# EAGLE schematic PR5004 (EAGLE 6.5.0)
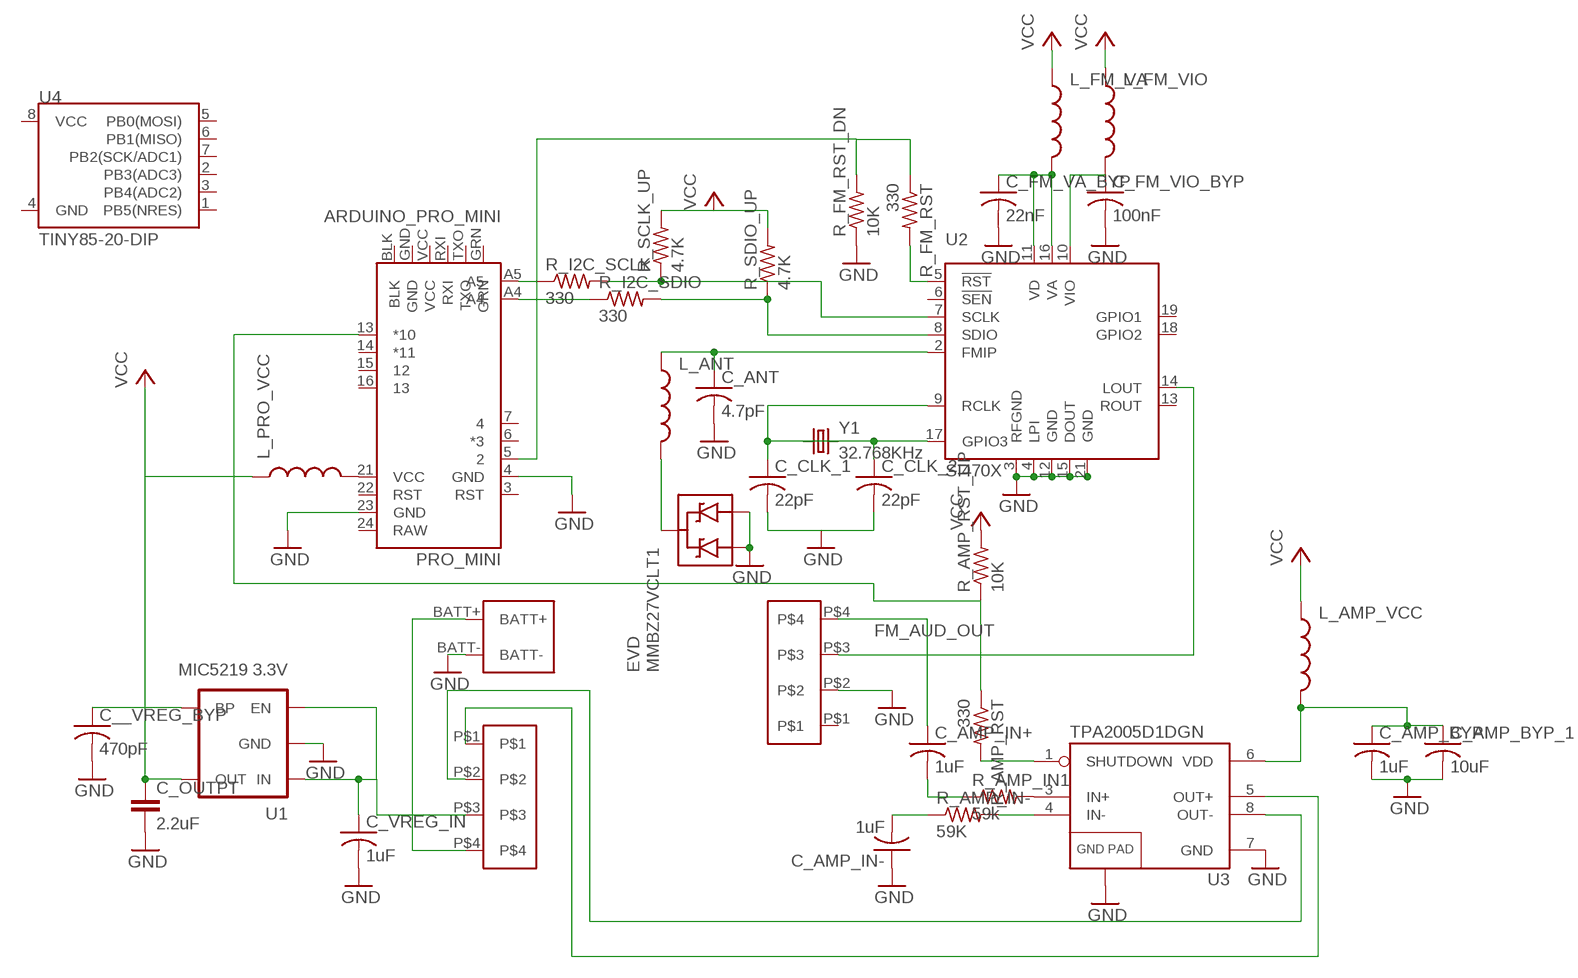
[diagram p0: schematic, sheet 1]

## Parts
ANT/POT_VOL  OSTVN04  [OSTVN04]
ANT/POT_VOL1  OSTVN04  [OSTVN04]
BATT_IN  KEYSTONE_2479_3XAAA_BOTTOM  [KEYSTONE_2479_3XAAA_BOTTOM]
C__VREG_BYP  470pF  C-USC0603  [C0603]
C_AMP_BYP  1uF  C-USC0603  [C0603]
C_AMP_BYP_1  10uF  C-USC0603  [C0603]
C_AMP_IN+  1uF  C-USC0603  [C0603]
C_AMP_IN-  1uF  C-USC0603  [C0603]
C_ANT  4.7pF  C-USC0805  [C0805]
C_CLK_1  22pF  C-USC0603  [C0603]
C_CLK_2  22pF  C-USC0603  [C0603]
C_FM_VA_BYP  22nF  C-USC0603  [C0603]
C_FM_VIO_BYP  100nF  C-USC0603  [C0603]
C_OUTPT  2.2uF  VISHAY_TR3C  [VISHAY_TR3C]
C_VREG_IN  1uF  C-USC0603  [C0603]
EVD  MMBZ27VCLT1  [SOT23-3]
L_AMP_VCC  INDUCTOR0603  [0603]
L_ANT  INDUCTOR0805  [0805]
L_FM_VA  INDUCTOR0603  [0603]
L_FM_VIO  INDUCTOR0603  [0603]
L_PRO_VCC  INDUCTOR0603  [0603]
PRO_MINI  ARDUINO_PRO_MINI  [ARDUINO_PRO_MINI]
R_AMP_IN1  59k  R-US_R0603  [R0603]
R_AMP_IN-  59K  R-US_R0603  [R0603]
R_AMP_RST  330  R-US_R0603  [R0603]
R_AMP_RST_UP  10K  R-US_R0603  [R0603]
R_FM_RST  330  R-US_R0603  [R0603]
R_FM_RST_DN  10K  R-US_R0603  [R0603]
R_I2C_SCLK  330  R-US_R0603  [R0603]
R_I2C_SDIO  330  R-US_R0603  [R0603]
R_SCLK_UP  4.7K  R-US_R0603  [R0603]
R_SDIO_UP  4.7K  R-US_R0603  [R0603]
U1  MIC5219 3.3V  V_REG_MIC52193.3V  [SOT23-5]
U2  SI470X  [SI470X]
U3  TPA2005D1DGN  [POWER-SOP8]
U4  TINY85-20-DIP  ATTINY45TINY85-20-DIP  [DIP08]
Y1  32.768KHz  CRYSTAL32-SMD  [CRYSTAL-32KHZ-SMD]

## Nets
ANT: EVD.3(C) L_ANT.2
BATT+: ANT/POT_VOL1.P$4 BATT_IN.BATT+
FM_AUD_OUT: ANT/POT_VOL.P$3 U2.14(LOUT)
GND [GND]: ANT/POT_VOL.P$2 BATT_IN.BATT- C__VREG_BYP.2 C_AMP_BYP.2 C_AMP_BYP_1.2 C_AMP_IN-.1 C_ANT.2 C_CLK_1.2 C_CLK_2.2 C_FM_VA_BYP.2 C_FM_VIO_BYP.2 C_OUTPT.P$2 C_VREG_IN.2 EVD.1(A1) EVD.2(A2) PRO_MINI.4(GND) PRO_MINI.23(GND) R_FM_RST_DN.1 U1.2(GND) U2.3(RFGND) U2.4(LPI) U2.12(GND) U2.15(DOUT) U2.21(GND) U3.7(GND) U3.9(GND)
N$1: C_AMP_IN-.2 R_AMP_IN-.1
N$2: C_AMP_IN+.2 R_AMP_IN1.1
N$3: C_CLK_1.1 U2.9(RCLK) Y1.X2
N$4: R_FM_RST.2 U2.5(!RST)
N$5: PRO_MINI.A5 R_I2C_SCLK.1
N$6: R_I2C_SCLK.2 R_SCLK_UP.1 U2.7(SCLK)
N$7: PRO_MINI.A4 R_I2C_SDIO.1
N$9: R_I2C_SDIO.2 R_SDIO_UP.1 U2.8(SDIO)
N$10: C_ANT.1 L_ANT.1 U2.2(FMIP)
N$11: C_CLK_2.1 U2.17(GPIO3) Y1.X1
N$14: R_AMP_IN1.2 U3.3(IN+)
N$15: R_AMP_IN-.2 U3.4(IN-)
N$16: ANT/POT_VOL1.P$2 U3.8(OUT-)
N$17: ANT/POT_VOL1.P$1 U3.5(OUT+)
N$19: R_AMP_RST.2 U3.1(SHUTDOWN)
N$20: ANT/POT_VOL1.P$3 C_VREG_IN.1 U1.1(IN) U1.3(EN)
N$23: PRO_MINI.5 R_FM_RST.1 R_FM_RST_DN.2
N$25: PRO_MINI.13(*10) R_AMP_RST.1 R_AMP_RST_UP.1
N$27: ANT/POT_VOL.P$4 C_AMP_IN+.1
N$28: C__VREG_BYP.1 U1.4(BP)
N$29: L_PRO_VCC.2 PRO_MINI.21(VCC)
N$30: C_FM_VIO_BYP.1 L_FM_VIO.2 U2.10(VIO)
N$31: C_FM_VA_BYP.1 L_FM_VA.2 U2.11(VD) U2.16(VA)
N$33: C_AMP_BYP.1 C_AMP_BYP_1.1 L_AMP_VCC.2 U3.6(VDD)
VCC: C_OUTPT.P$1 L_AMP_VCC.1 L_FM_VA.1 L_FM_VIO.1 L_PRO_VCC.1 R_AMP_RST_UP.2 R_SCLK_UP.2 R_SDIO_UP.2 U1.5(OUT)
Unconnected: ANT/POT_VOL.P$1 PRO_MINI.3(RST) PRO_MINI.6(*3) PRO_MINI.7 PRO_MINI.14(*11) PRO_MINI.15 PRO_MINI.16 PRO_MINI.22(RST) PRO_MINI.24(RAW) PRO_MINI.BLK PRO_MINI.GND PRO_MINI.GRN PRO_MINI.RXI PRO_MINI.TXO PRO_MINI.VCC U2.6(!SEN) U2.13(ROUT) U2.18(GPIO2) U2.19(GPIO1) U4.1(PB5(NRES)) U4.2(PB3(ADC3)) U4.3(PB4(ADC2)) U4.4(GND) U4.5(PB0(MOSI)) U4.6(PB1(MISO)) U4.7(PB2(SCK/ADC1)) U4.8(VCC)

## Library data of the parts
ANT/POT_VOL ANT/POT_VOL1 = OSTVN On-Shore Term:OSTVN04
BATT_IN = Batteries:KEYSTONE_2479_3XAAA_BOTTOM
C__VREG_BYP C_AMP_BYP C_AMP_BYP_1 C_AMP_IN+ C_AMP_IN- C_ANT C_CLK_1 C_CLK_2 C_FM_VA_BYP C_FM_VIO_BYP C_VREG_IN = resistor:C-US: CAPACITOR, American symbol
C_OUTPT = capacitor-wima:VISHAY_TR3C
EVD = SparkFun-DiscreteSemi:MMBZ27VCLT1: 40W Zener-diode transient voltage suppressor (ESD protection)
L_AMP_VCC L_ANT L_FM_VA L_FM_VIO L_PRO_VCC = SparkFun-Passives:INDUCTOR: Inductors Basic Inductor/Choke - 0603 and 1206. Footprints are not proven and vary greatly between part numbers. SRN6045- 33uH, 20% 1.4A SDR0403-560KL - 56uH, 10%, 500mA RMS/740mA peak
PRO_MINI = Sparkfun_MODIFIED_2:ARDUINO_PRO_MINI
R_AMP_IN1 R_AMP_IN- R_AMP_RST R_AMP_RST_UP R_FM_RST R_FM_RST_DN R_I2C_SCLK R_I2C_SDIO R_SCLK_UP R_SDIO_UP = resistor:R-US_: RESISTOR, American symbol
U1 = SparkFun-PowerIC:V_REG_MIC5219: V_REG MIC5219 Standard 3.3V and 5V 500mA LDO voltage regulator in SOT-23 layout. Micrel part MIC5219. BP (by-pass) pin is used to lower output noise with 470pF cap, may be left open.; PROD_ID: VREG-09872
U2 = SparkFun-RF:SI470X: FM receiver IC. Tested with Si4703. You really only need SEN, RST, SCLK, and SDIO to get a full FM radio working. Antenna comes from headphone jack. See BOB-10344.
U3 = SparkFun-AnalogIC:TPA2005D1: 1.4W MONO CLASS-D AUDIO POWER AMPLIFIER The TPA2005D1 is a 1.4-W high efficiency filter-free class-D audio power amplifier in a BGA, QFN, or MSOP package that requires only three external components. Datasheet: http://focus.ti.com/lit/ds/symlink/tpa2005d1.pdf 1.4 W Into 8 ? From a 5V Supply at THD = 10% (Typ) Maximum Battery Life and Minimum Heat Efficiency With an 8-? Speaker: 84% at 400 mW, 79% at 100 mW 2.8-mA Quiescent Current 0.5-mA Shutdown Current Ideal for Wireless or Cellular Handsets and PDAs Capable of Driving an 8-? Speaker (2.5 V ? VDD ? 5.5 V) and a 4-? Speaker (2.5 V ? VDD ? 4.2 V) Only Three External Components Optimized PWM Output Stage Eliminates LC Output Filter Internally Generated 250-kHz Switching Frequency Eliminates Capacitor and Resistor Improved PSRR (-71 dB at 217 Hz) and Wide Supply Voltage (2.5 V to 5.5 V) Eliminates Need for a Voltage Regulator Fully Differential Design Reduces RF Rectification and Eliminates Bypass Capacitor Improved CMRR Eliminates Two Input Coupling Capacitors
U4 = SparkFun-DigitalIC:ATTINY45: Atmel 8-pin 2/4/8kB flash uC; PROD_ID: IC-09445
Y1 = SparkFun-FreqCtrl:CRYSTAL: Various standard crystals. Proven footprints. Spark Fun Electronics SKU : COM-00534; PROD_ID: XTAL-07894

## Net classes
1 GND: width 0.61 mm